# Altium schematic sheet CoreWithUsart.SchDoc
size A4
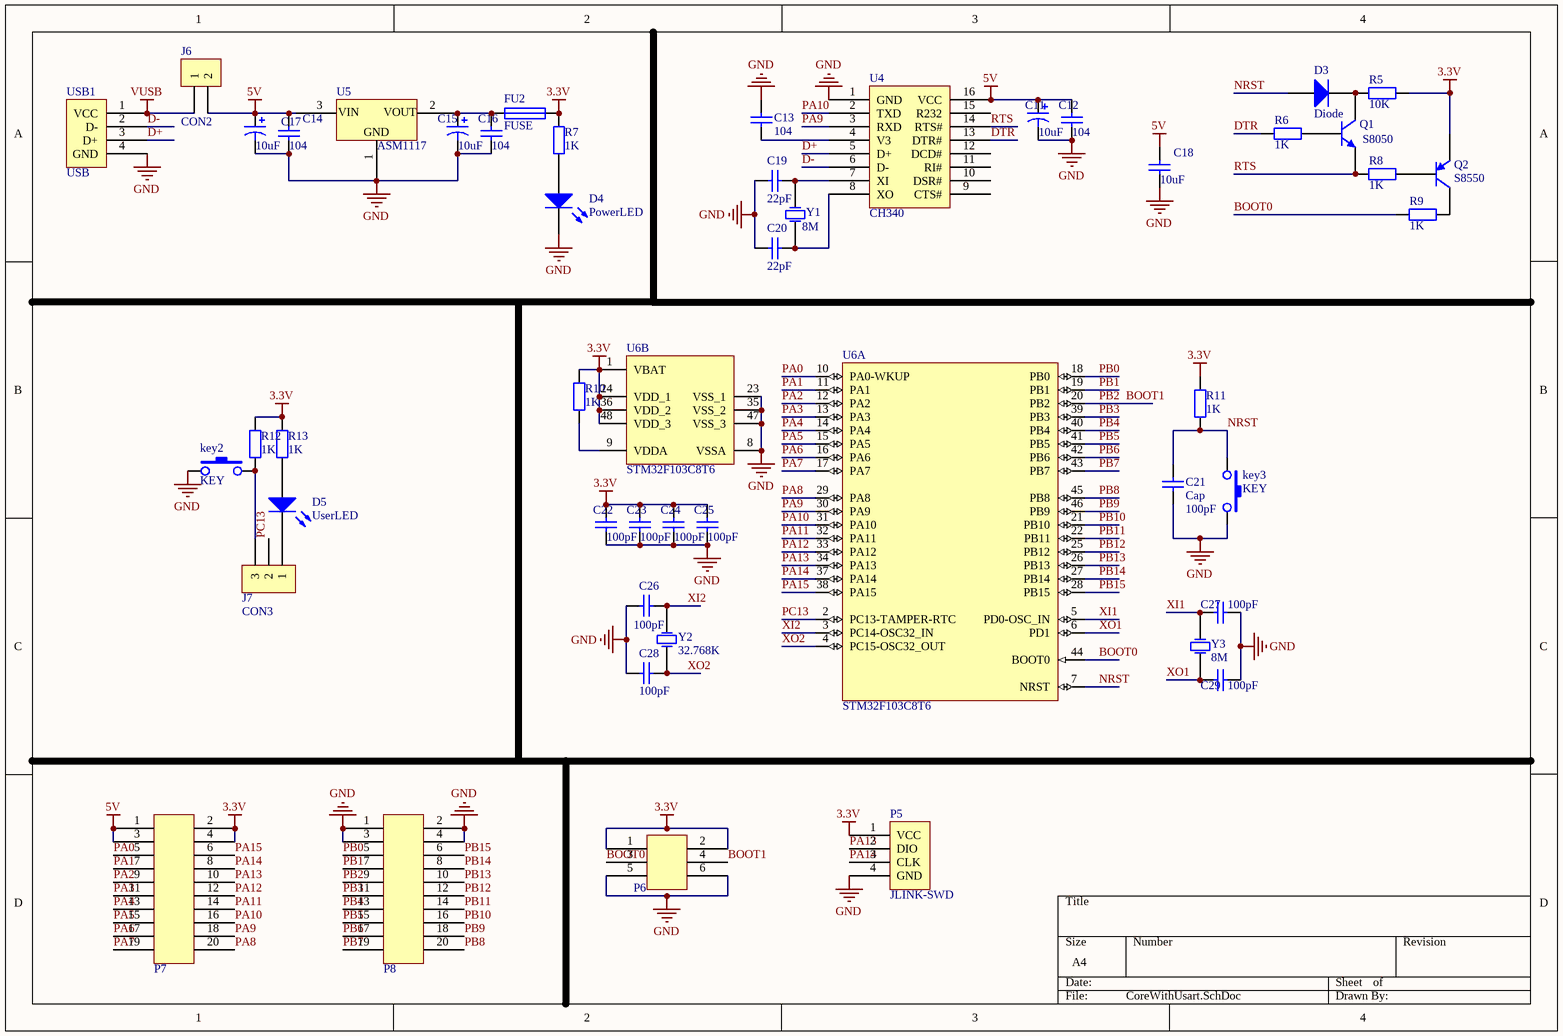
[diagram p0: CoreWithUsart.SchDoc]

## Parts
C11  value 10uF  [0603R]  (hidden comment: Cap Pol)
C12  value 104  [0603R]  (hidden comment: Cap)
C13  value 104  [0603R]  (hidden comment: Cap)
C14  value 104  [0603R]  (hidden comment: Cap)
C15  value 10uF  [0603R]  (hidden comment: Cap Pol)
C16  value 104  [0603R]  (hidden comment: Cap)
C17  value 10uF  [0603R]  (hidden comment: Cap Pol)
C18  value 10uF  [0603R]  (hidden comment: Cap)
C19  value 22pF  [0603R]  (hidden comment: Cap)
C20  value 22pF  [0603R]  (hidden comment: Cap)
C21  Cap  value 100pF  [0603R]
C22  value 100pF  [0603R]  (hidden comment: Cap)
C23  value 100pF  [0603R]  (hidden comment: Cap)
C24  value 100pF  [0603R]  (hidden comment: Cap)
C25  value 100pF  [0603R]  (hidden comment: Cap)
C26  value 100pF  [0603R]  (hidden comment: Cap)
C27  value 100pF  [0603R]  (hidden comment: Cap)
C28  value 100pF  [0603R]  (hidden comment: Cap)
C29  value 100pF  [0603R]  (hidden comment: Cap)
D3  Diode  [贴片二极管]
D4  PowerLED  [0805]
D5  UserLED  [0805]
FU2  FUSE  [1812R]
J6  CON2  [SIP2]
J7  CON3  [SIP3]
key2  KEY  [3*6*2.5KEY]
key3  KEY  [3*6*2.5KEY]
P5  JLINK-SWD  [SIP4]
P6  CON2X3  [SIP2x3]  (value not drawn)
P7  CON2X10  [SIP2x10]  (value not drawn)
P8  CON2X10  [SIP2x10]  (value not drawn)
Q1  S8050  [SOT-23]
Q2  S8550  [SOT-23]
R5  value 10K  [0603R]  (hidden comment: Res)
R6  value 1K  [0603R]  (hidden comment: Res)
R7  value 1K  [0603R]  (hidden comment: Res)
R8  value 1K  [0603R]  (hidden comment: Res)
R9  value 1K  [0603R]  (hidden comment: Res)
R10  value 1K  [0603R]  (hidden comment: Res)
R11  value 1K  [0603R]  (hidden comment: Res)
R12  value 1K  [0603R]  (hidden comment: Res)
R13  value 1K  [0603R]  (hidden comment: Res)
U4  CH340  [CH340G]
U5  ASM1117  [SOT223]
U6  STM32F103C8T6  [LQFP48_N]  (parts A,B of 2)
USB1  USB  [Micro_USB]
Y1  value 8M  [XTAL]  (hidden comment: XTAL)
Y2  value 32.768K  [XTAL32]  (hidden comment: XTAL)
Y3  value 8M  [XTAL]  (hidden comment: XTAL)

## Nets
3.3V: C22.1 C23.1 C24.1 C25.1 FU2.2 P5.1(VCC) P6.1 P6.2 P7.2 P7.4 Q2.3(E) R5.1 R7.1 R10.2 R11.2 R12.1 R13.1 U6.1(VBAT) U6.24(VDD_1) U6.36(VDD_2) U6.48(VDD_3)
5V: C11.1 C12.1 C14.1 C17.1 C18.1 J6.2 P7.1 P7.3 U4.16(VCC) U5.3(VIN)
GND: C11.2 C12.2 C13.2 C14.2 C15.2 C16.2 C17.2 C18.2 C19.1 C20.1 C21.1 C22.2 C23.2 C24.2 C25.2 C26.1 C27.1 C28.1 C29.1 D4.2(K) key2.1 key3.2 P5.4(GND) P6.5 P6.6 P8.1 P8.2 P8.3 P8.4 U4.1(GND) U5.1(GND) U6.8(VSSA) U6.23(VSS_1) U6.35(VSS_2) U6.47(VSS_3) USB1.4(GND)
VUSB: J6.1 USB1.1(VCC)
BOOT0: P6.3 R9.2 U6.44(BOOT0)
BOOT1: P6.4 P8.9 U6.20(PB2)  [also labelled PB2]
D+: U4.5(D+) USB1.3(D+)
D-: U4.6(D-) USB1.2(D-)
DTR: R6.1 U4.13(DTR#)
NRST: C21.2 D3.1(A) key3.1 R11.1 U6.7(NRST)
PA0: P7.5 U6.10(PA0-WKUP)
PA1: P7.7 U6.11(PA1)
PA2: P7.9 U6.12(PA2)
PA3: P7.11 U6.13(PA3)
PA4: P7.13 U6.14(PA4)
PA5: P7.15 U6.15(PA5)
PA6: P7.17 U6.16(PA6)
PA7: P7.19 U6.17(PA7)
PA8: P7.20 U6.29(PA8)
PA9: P7.18 U4.3(RXD) U6.30(PA9)
PA10: P7.16 U4.2(TXD) U6.31(PA10)
PA11: P7.14 U6.32(PA11)
PA12: P7.12 U6.33(PA12)
PA13: P5.2(DIO) P7.10 U6.34(PA13)
PA14: P5.3(CLK) P7.8 U6.37(PA14)
PA15: P7.6 U6.38(PA15)
PB0: P8.5 U6.18(PB0)
PB1: P8.7 U6.19(PB1)
PB3: P8.11 U6.39(PB3)
PB4: P8.13 U6.40(PB4)
PB5: P8.15 U6.41(PB5)
PB6: P8.17 U6.42(PB6)
PB7: P8.19 U6.43(PB7)
PB8: P8.20 U6.45(PB8)
PB9: P8.18 U6.46(PB9)
PB10: P8.16 U6.21(PB10)
PB11: P8.14 U6.22(PB11)
PB12: P8.12 U6.25(PB12)
PB13: P8.10 U6.26(PB13)
PB14: P8.8 U6.27(PB14)
PB15: P8.6 U6.28(PB15)
PC13: J7.2 U6.2(PC13-TAMPER-RTC)
RTS: Q1.3(E) R8.1 U4.14(RTS#)
XI1: C27.2 U6.5(PD0-OSC_IN) Y3.1(OSC1)
XI2: C26.2 U6.3(PC14-OSC32_IN) Y2.2(OSC2)
XO1: C29.2 U6.6(PD1) Y3.2(OSC2)
XO2: C28.2 U6.4(PC15-OSC32_OUT) Y2.1(OSC1)
NetC13_1: C13.1 U4.4(V3)
NetC15_1: C15.1 C16.1 FU2.1 U5.2(VOUT)
NetC19_2: C19.2 U4.7(XI) Y1.2(OSC2)
NetC20_2: C20.2 U4.8(XO) Y1.1(OSC1)
NetD3_2: D3.2(K) Q1.1(C) R5.2
NetD4_1: D4.1(A) R7.2
NetD5_1: D5.1(A) R13.2
NetD5_2: D5.2(K) J7.1
NetJ7_3: J7.3 key2.2 R12.2
NetQ1_2: Q1.2(B) R6.2
NetQ2_1: Q2.1(C) R9.1
NetQ2_2: Q2.2(B) R8.2
NetR10_1: R10.1 U6.9(VDDA)

Not connected (* = marked no-connect by the designer): U4 9(CTS#) 10(DSR#) 11(RI#) 12(DCD#) 15(R232)

## Library data of the parts
C11 C15 C17 = Cap Pol: Polarized Capacitor (Axial); Published: 8-Jun-2000; LatestRevisionDate: 17-Jul-2002; LatestRevisionNote: Re-released for DXP Platform.; PackageReference: POLAR0.8; Publisher: Altium Limited
C12-C14 C16 C18-C29 = Cap: Capacitor; Published: 8-Jun-2000; LatestRevisionDate: 17-Jul-2002; LatestRevisionNote: Re-released for DXP Platform.; PackageReference: RAD-0.3; Publisher: Altium Limited
D3 = Diode: Default Diode; Published: 8-Jun-2000; LatestRevisionDate: 17-Jul-2002; LatestRevisionNote: Re-released for DXP Platform.; PackageDocument: Sep-1996; PackageReference: SMC; Publisher: Altium Limited; Code_JEDEC: DO-214-AB
D4 D5 = LED: Typical INFRARED GaAs LED; Published: 8-Jun-2000; LatestRevisionDate: 08-Jul-2005; LatestRevisionNote: Mech Layer 1 removed.; PackageReference: LED-0; Publisher: Altium Limited
Q1 = NPN: NPN Bipolar Transistor; Published: 8-Jun-2000; LatestRevisionDate: 17-Jul-2002; LatestRevisionNote: Re-released for DXP Platform.; PackageReference: TO-226; Publisher: Altium Limited; Code_JEDEC: TO-226-AA
Q2 = PNP: PNP Bipolar Transistor; Published: 8-Jun-2000; LatestRevisionDate: 17-Jul-2002; LatestRevisionNote: Re-released for DXP Platform.; PackageReference: SOT-23B; Publisher: Altium Limited; Code_JEDEC: SOT-23
R5-R13 = Res: Resistor; Published: 8-Jun-2000; LatestRevisionDate: 17-Jul-2002; LatestRevisionNote: Re-released for DXP Platform.; PackageReference: AXIAL-0.4; Publisher: Altium Limited
U6 = STM32F103C8T6: STM32 ARM-based 32-bit MCU Performance Line with 64 kB Flash, 20 kB Internal RAM, -40 to +85°C Temperature, 48-Pin LQFP, Tray; DatasheetVersion: rev13.0, Apr-2011; PackageVersion: rev13, Apr-2011; PackageReference: LQFP48; PackageDescription: 48-Pin Low-Profile Quad Flat Pack, 7 x 7 mm Body, 0.5 mm Pitch (LQFP48); ComponentLink1Description: Manufacturer URL; ComponentLink1URL: http://www.st.com/; ComponentLink2Description: STM32F103 Datasheet; ComponentLink2URL: http://www.st.com/internet/com/TECHNICAL_RESOURCES/TECHNICAL_LITERATURE/DATASHEET/CD00161566.pdf; ComponentLink3Description: STM32 Family Web Page; ComponentLink3URL: www.st.com/stm32
Y1-Y3 = XTAL: Crystal Oscillator